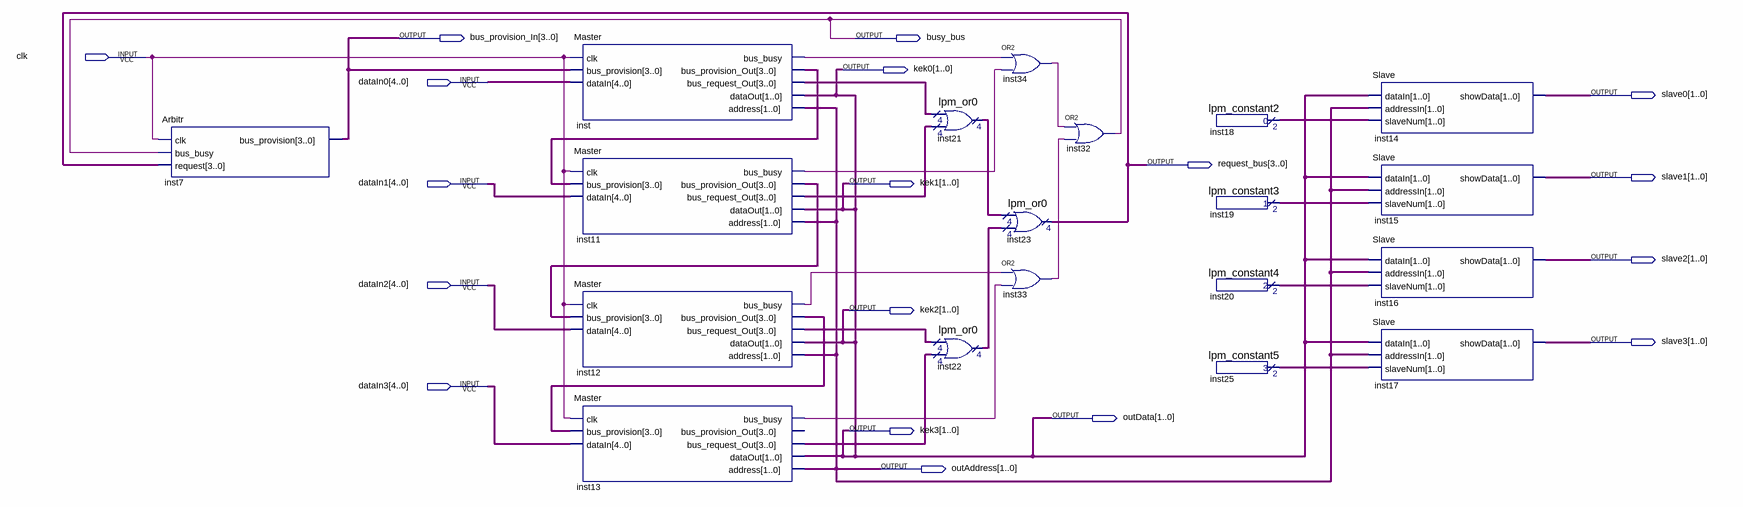
[diagram p0: schematic sheet]
// Quartus schematic laba5.bdf as structural Verilog: 19 symbols, 18 pins
module laba5 (
  input  clk,
  input  [4:0] dataIn0,
  input  [4:0] dataIn1,
  input  [4:0] dataIn2,
  input  [4:0] dataIn3,
  output [3:0] bus_provision_In,
  output busy_bus,
  output [1:0] kek0,
  output [1:0] slave0,
  output [3:0] request_bus,
  output [1:0] slave1,
  output [1:0] kek1,
  output [1:0] slave2,
  output [1:0] kek2,
  output [1:0] slave3,
  output [1:0] outData,
  output [1:0] kek3,
  output [1:0] outAddress
);

  wire inst11_bus_busy, inst12_bus_busy, inst13_bus_busy, inst33_out, inst34_out, inst_bus_busy;
  wire [1:0] inst18_result, inst19_result, inst20_result, inst25_result;
  wire [3:0] inst11_bus_provision_out, inst11_bus_request_out, inst12_bus_provision_out,
       inst12_bus_request_out, inst13_bus_request_out, inst21_result, inst22_result, inst_bus_provision_out,
       inst_bus_request_out;

  Arbitr inst7 (.clk(clk), .bus_busy(busy_bus), .request(request_bus), .bus_provision(bus_provision_In));
  Master inst (
    .clk(clk), .bus_provision(bus_provision_In), .dataIn(dataIn0), .bus_busy(inst_bus_busy),
    .bus_provision_Out(inst_bus_provision_out), .bus_request_Out(inst_bus_request_out), .dataOut(kek0),
    .address(outAddress));
  Master inst11 (
    .clk(clk), .bus_provision(inst_bus_provision_out), .dataIn(dataIn1), .bus_busy(inst11_bus_busy),
    .bus_provision_Out(inst11_bus_provision_out), .bus_request_Out(inst11_bus_request_out), .dataOut(kek0),
    .address(outAddress));
  Master inst12 (
    .clk(clk), .bus_provision(inst11_bus_provision_out), .dataIn(dataIn2), .bus_busy(inst12_bus_busy),
    .bus_provision_Out(inst12_bus_provision_out), .bus_request_Out(inst12_bus_request_out), .dataOut(kek0),
    .address(outAddress));
  Master inst13 (
    .clk(clk), .bus_provision(inst12_bus_provision_out), .dataIn(dataIn3), .bus_busy(inst13_bus_busy),
    .bus_request_Out(inst13_bus_request_out), .dataOut(kek0), .address(outAddress));  // open: bus_provision_Out
  lpm_or0 inst21 (.data0x(inst_bus_request_out), .data1x(inst11_bus_request_out), .result(inst21_result));
  lpm_or0 inst22 (.data0x(inst12_bus_request_out), .data1x(inst13_bus_request_out), .result(inst22_result));
  or inst34 (inst34_out, inst_bus_busy, inst11_bus_busy);
  lpm_or0 inst23 (.data0x(inst21_result), .data1x(inst22_result), .result(request_bus));
  or inst33 (inst33_out, inst12_bus_busy, inst13_bus_busy);
  or inst32 (busy_bus, inst34_out, inst33_out);
  lpm_constant2 inst18 (.result(inst18_result));
  lpm_constant3 inst19 (.result(inst19_result));
  lpm_constant4 inst20 (.result(inst20_result));
  lpm_constant5 inst25 (.result(inst25_result));
  Slave inst14 (.dataIn(kek0), .addressIn(outAddress), .slaveNum(inst18_result), .showData(slave0));
  Slave inst15 (.dataIn(kek0), .addressIn(outAddress), .slaveNum(inst19_result), .showData(slave1));
  Slave inst16 (.dataIn(kek0), .addressIn(outAddress), .slaveNum(inst20_result), .showData(slave2));
  Slave inst17 (.dataIn(kek0), .addressIn(outAddress), .slaveNum(inst25_result), .showData(slave3));

  assign kek1 = kek0;
  assign kek2 = kek0;
  assign kek3 = kek0;
  assign outData = kek0;
endmodule
